# Altium schematic sheet Freedom_E310.SchDoc: Freedom E310
size B; Revision: B01; SheetNumber: 3; SheetTotal: 5; ProjectCodeName: HiFive1; ProjectName: Cinque
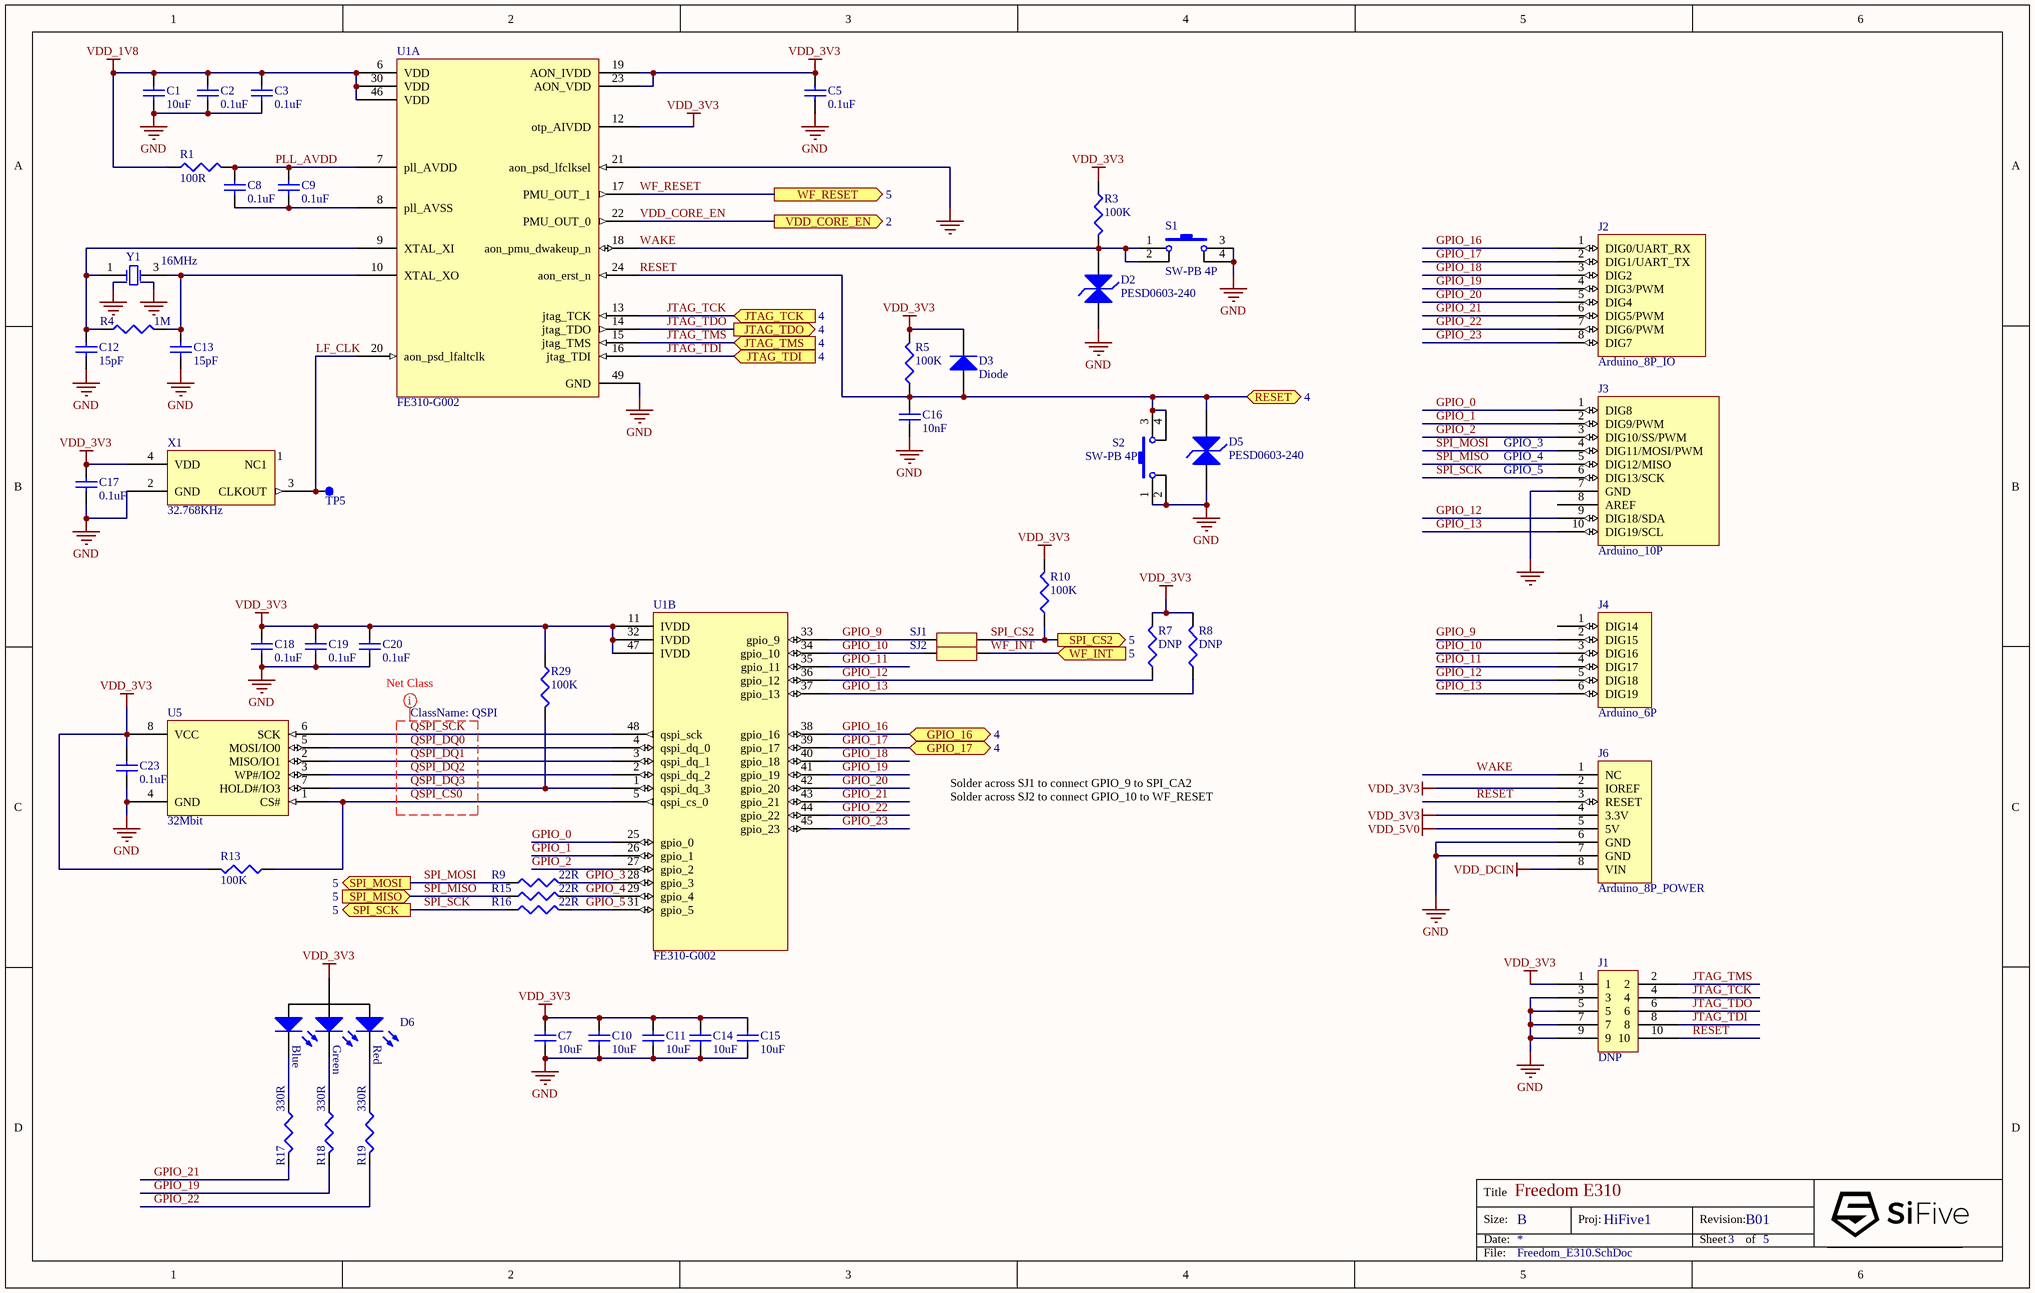
[diagram p0: Freedom_E310.SchDoc]

## Parts
C1  10uF  [C0603]
C2  0.1uF  [C0402]
C3  0.1uF  [C0402]
C5  0.1uF  [C0402]
C7  10uF  [C0603]
C8  0.1uF  [C0402]
C9  0.1uF  [C0402]
C10  10uF  [C0603]
C11  10uF  [C0603]
C12  15pF  [C0402]
C13  15pF  [C0402]
C14  10uF  [C0603]
C15  10uF  [C0603]
C16  10nF  [C0402]
C17  0.1uF  [C0402]
C18  0.1uF  [C0402]
C19  0.1uF  [C0402]
C20  0.1uF  [C0402]
C23  0.1uF  [C0402]
D2  PESD0603-240  [R0603]
D3  Diode  [SOD523]
D5  PESD0603-240  [R0603]
D6  LED_RGB_LTST-C19HE1WT  [LED0606]  (value not drawn)
J1  DNP  [CNC_3221-10-0300-00]  (no BOM)
J2  Arduino_8P_IO  [Arduino_8P_IO]
J3  Arduino_10P  [Arduino_10P]
J4  Arduino_6P  [Arduino_6P]
J6  Arduino_8P_POWER  [Arduino_8P_POWER]
R1  100R  [R0402]
R3  100K  [R0402]
R4  1M  [R0402]
R5  100K  [R0402]
R7  DNP  [R0402]  (no BOM)
R8  DNP  [R0402]  (no BOM)
R9  22R  [R0402]
R10  100K  [R0402]
R13  100K  [R0402]
R15  22R  [R0402]
R16  22R  [R0402]
R17  330R  [R0402]
R18  330R  [R0402]
R19  330R  [R0402]
R29  100K  [R0402]
S1  SW-PB 4P  [PTS645_SMT]
S2  SW-PB 4P  [PTS645_SMT]
SJ1  Solder Jumper  [SJ0805]  (value not drawn)  (no BOM)
SJ2  Solder Jumper  [SJ0805]  (value not drawn)  (no BOM)
TP5  Testpoint  [Testpoint_SMT]  (value not drawn)  (no BOM)
U1  FE310-G002  [QFN48_40P600X600X90_HS-49]  (parts A,B of 2)
U5  32Mbit  [SOIC127P790X216-8N]
X1  32.768KHz  [SiTime2012]
Y1  16MHz  [X3225]

## Ports
GPIO_16 (bidir, see 4), GPIO_17 (bidir, see 4), JTAG_TCK (in, see 4), JTAG_TDI (in, see 4), JTAG_TDO (out, see 4), JTAG_TMS (in, see 4), RESET (bidir, see 4), SPI_CS2 (out, see 5), SPI_MISO (in, see 5), SPI_MOSI (out, see 5), SPI_SCK (out, see 5), VDD_CORE_EN (out, see 2), WF_INT (in, see 5), WF_RESET (out, see 5)

## Nets
GND: C1.2 C2.1 C3.1 C5.1 C7.2 C10.2 C11.2 C12.2 C13.2 C14.2 C15.2 C16.2 C17.1 C18.1 C19.1 C20.1 C23.1 D2.2 D5.2 J1.3 J1.5 J1.7 J1.9 J3.7(GND) J6.6(GND) J6.7(GND) S1.3 S1.4 S2.1 S2.2 U1.21(aon_psd_lfclksel) U1.49(GND) U5.4(GND) X1.2(GND) Y1.2(NC1) Y1.4(NC2)
VDD_1V8: C1.1 C2.2 C3.2 R1.1 U1.6(VDD) U1.30(VDD) U1.46(VDD)
VDD_3V3: C5.2 C7.1 C10.1 C11.1 C14.1 C15.1 C17.2 C18.2 C19.2 C20.2 C23.2 D3.1(K) D6.4(A) J1.1 J6.2(IOREF) J6.4(3.3V) R3.1 R5.2 R7.2 R8.2 R10.2 R13.2 R29.1 U1.11(IVDD) U1.12(otp_AIVDD) U1.19(AON_IVDD) U1.23(AON_VDD) U1.32(IVDD) U1.47(IVDD) U5.8(VCC) X1.4(VDD)
VDD_5V0: J6.5(5V)
VDD_DCIN: J6.8(VIN)
GPIO_0: J3.1(DIG8) U1.25(gpio_0)
GPIO_1: J3.2(DIG9/PWM) U1.26(gpio_1)
GPIO_2: J3.3(DIG10/SS/PWM) U1.27(gpio_2)
GPIO_3: R9.2 U1.28(gpio_3)
GPIO_4: R15.2 U1.29(gpio_4)
GPIO_5: R16.2 U1.31(gpio_5)
GPIO_9: J4.2(DIG15) SJ1.1 U1.33(gpio_9)
GPIO_10: J4.3(DIG16) SJ2.1 U1.34(gpio_10)
GPIO_11: J4.4(DIG17) U1.35(gpio_11)
GPIO_12: J3.9(DIG18/SDA) J4.5(DIG18) R7.1 U1.36(gpio_12)
GPIO_13: J3.10(DIG19/SCL) J4.6(DIG19) R8.1 U1.37(gpio_13)
GPIO_16: J2.1(DIG0/UART_RX) U1.38(gpio_16) ; port GPIO_16
GPIO_17: J2.2(DIG1/UART_TX) U1.39(gpio_17) ; port GPIO_17
GPIO_18: J2.3(DIG2) U1.40(gpio_18)
GPIO_19: J2.4(DIG3/PWM) R18.2 U1.41(gpio_19)
GPIO_20: J2.5(DIG4) U1.42(gpio_20)
GPIO_21: J2.6(DIG5/PWM) R17.2 U1.43(gpio_21)
GPIO_22: J2.7(DIG6/PWM) R19.2 U1.44(gpio_22)
GPIO_23: J2.8(DIG7) U1.45(gpio_23)
JTAG_TCK: J1.4 U1.13(jtag_TCK) ; port JTAG_TCK
JTAG_TDI: J1.8 U1.16(jtag_TDI) ; port JTAG_TDI
JTAG_TDO: J1.6 U1.14(jtag_TDO) ; port JTAG_TDO
JTAG_TMS: J1.2 U1.15(jtag_TMS) ; port JTAG_TMS
LF_CLK: TP5.1 U1.20(aon_psd_lfaltclk) X1.3(CLKOUT)
PLL_AVDD: C8.2 C9.2 R1.2 U1.7(pll_AVDD)
QSPI_CS0: R13.1 U1.5(qspi_cs_0) U5.1(CS#)
QSPI_DQ0: U1.4(qspi_dq_0) U5.5(MOSI/IO0)
QSPI_DQ1: U1.3(qspi_dq_1) U5.2(MISO/IO1)
QSPI_DQ2: U1.2(qspi_dq_2) U5.3(WP#/IO2)
QSPI_DQ3: R29.2 U1.1(qspi_dq_3) U5.7(HOLD#/IO3)
QSPI_SCK: U1.48(qspi_sck) U5.6(SCK)
RESET: C16.1 D3.2(A) D5.1 J1.10 J6.3(RESET) R5.1 S2.3 S2.4 U1.24(aon_erst_n) ; port RESET
SPI_CS2: R10.1 SJ1.2 ; port SPI_CS2
SPI_MISO: J3.5(DIG12/MISO) R15.1 ; port SPI_MISO
SPI_MOSI: J3.4(DIG11/MOSI/PWM) R9.1 ; port SPI_MOSI
SPI_SCK: J3.6(DIG13/SCK) R16.1 ; port SPI_SCK
VDD_CORE_EN: U1.22(PMU_OUT_0) ; port VDD_CORE_EN
WAKE: D2.1 J6.1(NC) R3.2 S1.1 S1.2 U1.18(aon_pmu_dwakeup_n)
WF_INT: SJ2.2 ; port WF_INT
WF_RESET: U1.17(PMU_OUT_1) ; port WF_RESET
NetC8_1: C8.1 C9.1 U1.8(pll_AVSS)
NetC12_1: C12.1 R4.1 U1.9(XTAL_XI) Y1.1(OSC1)
NetC13_1: C13.1 R4.2 U1.10(XTAL_XO) Y1.3(OSC2)
NetD6_1: D6.1(RedK) R19.1
NetD6_2: D6.2(GreenK) R18.1
NetD6_3: D6.3(BlueK) R17.1

Not connected (* = marked no-connect by the designer): J3 8(AREF); J4 1(DIG14); X1 1(NC1)

## Layout directives
net class QSPI: QSPI_CS0, QSPI_DQ0, QSPI_DQ1, QSPI_DQ2, QSPI_DQ3, QSPI_SCK

## Notes on the sheet
- GPIO_3
- GPIO_4
- GPIO_5
- Solder across SJ1 to connect GPIO_9 to SPI_CA2
  Solder across SJ2 to connect GPIO_10 to WF_RESET
- Title
- Size:
- Date:
- B
- Proj:
- Revision:
- Sheet
- of
- File:
- (in symbol E0000005) Blue; Green; Red

## Library data of the parts
C1 C7 C10 C11 C14 C15 = C0100033: CAP CER 10UF 10V X5R 0603; Manufacturer: Murata Electronics; Manufacturer PN: GRM188R61A106KE69J; Tolerance: ±10%; Part Number: C0100033; Value: 10uF; Type: X5R; Voltage Rating: 10V; Operating Temperature: -55°C ~ 85°C
C2 C3 C5 C8 C9 C17-C20 C23 = C0100004: 0.10µF 16V Ceramic Capacitor X7R 0402; Manufacturer: Samsung Electro-Mechanics; Manufacturer PN: CL05B104KO5NFNC; Tolerance: ±10%; Part Number: C0100004; Value: 0.1uF; Type: X7R; Voltage Rating: 16V; Operating Temperature: -55°C ~ 125°C
C12 C13 = C0100038: CAP CER 15PF 50V C0G/NPO 0402; Manufacturer: Yageo; Manufacturer PN: CC0402JRNPO9BN150; Type: C0G; Tolerance: ±5%; Part Number: C0100038; Value: 15pF; Voltage Rating: 50V; Operating Temperature: -55°C ~ 125°C
C16 = C0100037: CAP CER 10000PF 50V X7R 0402; Manufacturer: Samsung Electro-Mechanics; Manufacturer PN: CL05B103KB5VPNC; Tolerance: ±10%; Part Number: C0100037; Value: 10nF; Type: X7R; Voltage Rating: 50V; Operating Temperature: -55°C ~ 125°C
D2 D5 = D0000013: TVS Diode 24VWM  45VClamp; Manufacturer: Littlefuse; Voltage Reverse Standoff: 24V; Part Number: D0000013; Value: PESD0603-240; Manufacturer PN: PESD0603-240; Temperature Range: -55°C ~ 125°C
D3 = D0000001: Diode Standard 80V 125mA Surface Mount SOD-523; Manufacturer: Diodes Incorporated; Value: 1N4148WT-7; Part Number: D0000001; Manufacturer PN: 1N4148WT-7; Temperature Range: -65°C ~ 150°C
D6 = E0000005: Red, Green, Blue (RGB) 624nm Red, 525nm Green, 470nm Blue LED Indication - Discrete 1.8V Red, 2.8V Green, 2.8V Blue 0606; Manufacturer: Lite-on Inc.; Part Number: E0000005; Value: RGB; Manufacturer PN: LTST-C19HE1WT; Temperature Range: -20°C ~ 80°C; Voltage Forward: 1.8V Red, 2.8V Green, 2.8V Blue
J1 = J0000049: Connector Header Surface Mount 10 position 0.050" (1.27mm); Manufacturer: CNC Tech; Manufacturer PN: 3221-10-0300-00; Part Number: J0000049
J2 = J0000005: Arduino 8 Pin I/O Connector; Manufacturer: Sullins Connector Solutions; Manufacturer PN: PPTC081LFBN-RC; Part Number: J0000005
J3 = J0000007: Arduino 10 Pin Connector; Manufacturer: Sullins Connector Solutions; Manufacturer PN: PPTC101LFBN-RC; Part Number: J0000007
J4 = J0000004: Arduino 6 Pin Connector; Manufacturer: Sullins Connector Solutions; Manufacturer PN: PPTC061LFBN-RC; Part Number: J0000004
J6 = J0000006: Arduino 8 Pin Power Connector; Manufacturer: Sullins Connector Solutions; Manufacturer PN: PPTC081LFBN-RC; Part Number: J0000006
R1 = R0000020: RES SMD 100 OHM 1% 1/16W 0402; Manufacturer: Yageo; Manufacturer PN: RC0402FR-07100RL; Power Rating: 0.063W; Part Number: R0000020; Value: 100R; Tolerance: ±1%; Type: Thick Film; Temperature Range: -55°C ~ 155°C
R3 R5 R10 R13 R29 = R0000012: RES SMD 100K OHM 1% 1/16W 0402; Manufacturer: Yageo; Manufacturer PN: RC0402FR-07100KL; Power Rating: 0.063W; Part Number: R0000012; Value: 100K; Tolerance: ±1%; Type: Thick Film; Temperature Range: -55°C ~ 155°C
R4 = R0000021: RES SMD 1M OHM 1% 1/16W 0402; Manufacturer: Yageo; Manufacturer PN: RC0402FR-071ML; Power Rating: 0.063W; Part Number: R0000021; Value: 1M; Tolerance: ±1%; Type: Thick Film; Temperature Range: -55°C ~ 155°C
R7 R8 = R0000025: RES SMD 2K OHM 1% 1/16W 0402; Manufacturer: Yageo; Manufacturer PN: RC0402FR-072KL; Power Rating: 0.063W; Part Number: R0000025; Value: 2K; Tolerance: ±1%; Type: Thick Film; Temperature Range: -55°C ~ 155°C
R9 R15 R16 = R0000022: RES SMD 22 OHM 1% 1/16W 0402; Manufacturer: Yageo; Manufacturer PN: RC0402FR-0722RL; Power Rating: 0.063W; Part Number: R0000022; Value: 22R; Tolerance: ±1%; Type: Thick Film; Temperature Range: -55°C ~ 155°C
R17-R19 = R0000026: RES SMD 330 OHM 1% 1/16W 0402; Manufacturer: Yageo; Manufacturer PN: RC0402FR-07330RL; Power Rating: 0.063W; Part Number: R0000026; Value: 330R; Tolerance: ±1%; Type: Thick Film; Temperature Range: -55°C ~ 155°C
S1 = M0000004: Blue Tactile Switch SPST-NO Top Actuated Surface Mount; Manufacturer: C & K Components; Manufacturer PN: PTS645SM43SMTR92 LFS; Part Number: M0000004
S2 = M0000003: Red Tactile Switch SPST-NO Top Actuated Surface Mount; Manufacturer: C & K Components; Manufacturer PN: PTS645SK43SMTR92 LFS; Part Number: M0000003
SJ1 SJ2 = M0000009: Solder Bridge 0805; Manufacturer: None; Part Number: M0000009; Manufacturer PN: None
TP5 = M0000002: Test Point SMT; Part Number: M0000002
U1 = U0000050: SiFive Freedom E310 Microcontroller; Part Number: U0000050; Value: FE310-G002; Manufacturer: SiFive; Manufacturer PN: FE310-G002; Temperature Range: -40°C ~ 85°C
U5 = U0000019: IC FLASH 32MBIT 133MHZ 8SOIC 2.3 V ~ 3.6 V; Manufacturer: ISSI; Manufacturer PN: IS25LP032D-JBLE; Part Number: U0000019; Value: 32Mbit; Temperature Range: -40°C ~ 105°C
X1 = X0000014: 32.768kHz LVCMOS MEMS (Silicon) Oscillator Surface Mount 1.2 V ~ 3.63 V 1.3µA; Manufacturer: SiTime; Manufacturer PN: SIT1533AI-H4-DCC-32.768E; Frequency Stability: ±100 ppm; Part Number: X0000014; Value: 32.768KHz; Temperature Range: -40°C ~ 85°C
Y1 = X0000015: 16MHz ±10ppm Crystal 9pF 60 Ohm; Manufacturer: Epson; Manufacturer PN: TSX-3225 16.0000MF18X-AC0; Frequency Stability: ±18ppm; ESR: 60 Ohms; Part Number: X0000015; Value: 16MHz; Temperature Range: -40°C ~ 85°C; Load Capacitance: 9pF; Frequency Tolerance: ±10ppm